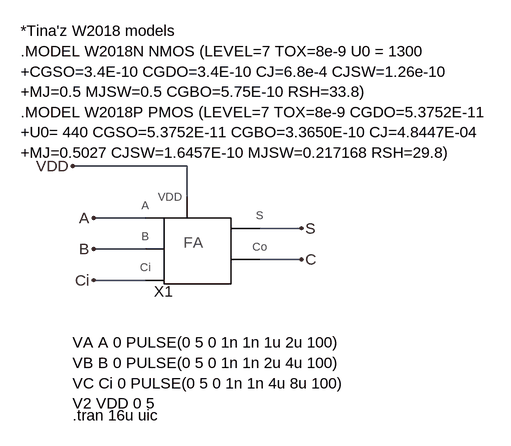
[diagram p0: schematic FATest.asc]
FATest.asc, the LTspice schematic file:
Version 4
SHEET 1 880 680
WIRE 240 224 64 224
WIRE 240 272 240 224
WIRE 176 304 96 304
WIRE 416 320 352 320
WIRE 176 352 96 352
WIRE 416 368 352 368
WIRE 176 400 96 400
FLAG 64 224 VDD
FLAG 96 304 A
FLAG 416 320 S
FLAG 96 352 B
FLAG 416 368 C
FLAG 96 400 Ci
SYMBOL FA 240 320 R0
SYMATTR InstName X1
TEXT -16 16 Left 2 !*Tina'z W2018 models\n.MODEL W2018N NMOS (LEVEL=7 TOX=8e-9 U0 = 1300\n+CGSO=3.4E-10 CGDO=3.4E-10 CJ=6.8e-4 CJSW=1.26e-10\n+MJ=0.5 MJSW=0.5 CGBO=5.75E-10 RSH=33.8)\n.MODEL W2018P PMOS (LEVEL=7 TOX=8e-9 CGDO=5.3752E-11\n+U0= 440 CGSO=5.3752E-11 CGBO=3.3650E-10 CJ=4.8447E-04\n+MJ=0.5027 CJSW=1.6457E-10 MJSW=0.217168 RSH=29.8)
TEXT 64 496 Left 2 !VA A 0 PULSE(0 5 0 1n 1n 1u 2u 100)\nVB B 0 PULSE(0 5 0 1n 1n 2u 4u 100)\nVC Ci 0 PULSE(0 5 0 1n 1n 4u 8u 100)\nV2 VDD 0 5
TEXT 64 608 Left 2 !.tran 16u uic

The netlist it stands for:
* FATest.asc
XX1 A B VDD S C Ci FA  ; pins A B VDD S Co Ci
*Tina'z W2018 models
.MODEL W2018N NMOS (LEVEL=7 TOX=8e-9 U0 = 1300
+CGSO=3.4E-10 CGDO=3.4E-10 CJ=6.8e-4 CJSW=1.26e-10
+MJ=0.5 MJSW=0.5 CGBO=5.75E-10 RSH=33.8)
.MODEL W2018P PMOS (LEVEL=7 TOX=8e-9 CGDO=5.3752E-11
+U0= 440 CGSO=5.3752E-11 CGBO=3.3650E-10 CJ=4.8447E-04
+MJ=0.5027 CJSW=1.6457E-10 MJSW=0.217168 RSH=29.8)
VA A 0 PULSE(0 5 0 1n 1n 1u 2u 100)
VB B 0 PULSE(0 5 0 1n 1n 2u 4u 100)
VC Ci 0 PULSE(0 5 0 1n 1n 4u 8u 100)
V2 VDD 0 5
.tran 16u uic
.backanno
.end